# Altium schematic sheet HMI.SchDoc
size A4
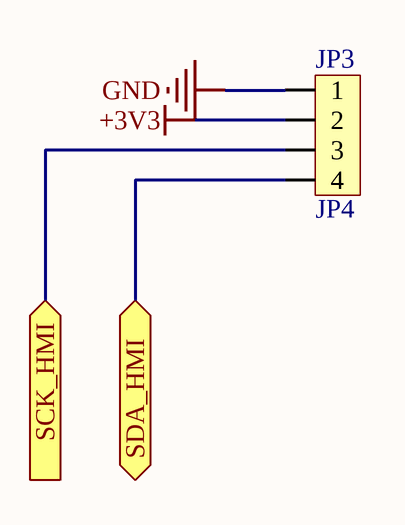
[diagram p0: HMI.SchDoc]

## Parts
JP3  JP4  [JP4-C1T]

## Ports
SCK_HMI (in), SDA_HMI (bidir)

## Nets
+3V3: JP3.2
GND: JP3.1
SCK_HMI: JP3.3 ; port SCK_HMI
SDA_HMI: JP3.4 ; port SDA_HMI

## Library data of the parts
JP3 = JP4: WR-PHD 2.54 mm Angled Socket Header; Manufacturer: W¨¹rth Elektronik eiSos GmbH; partNo: 613004143121; ComponentLink1 Description: Manufacturer; ComponentLink2 Description: Datasheet; NoPins: 04; Created Date: 29 March 2013; ComponentLink1URL: http://www.we-online.com; ComponentLink2URL: http://katalog.we-online.de/em/datasheet/6130xx143121.pdf; Created by: Karrer Zheng